# EAGLE schematic TalkieMo_1_0 (EAGLE 6.6.0)
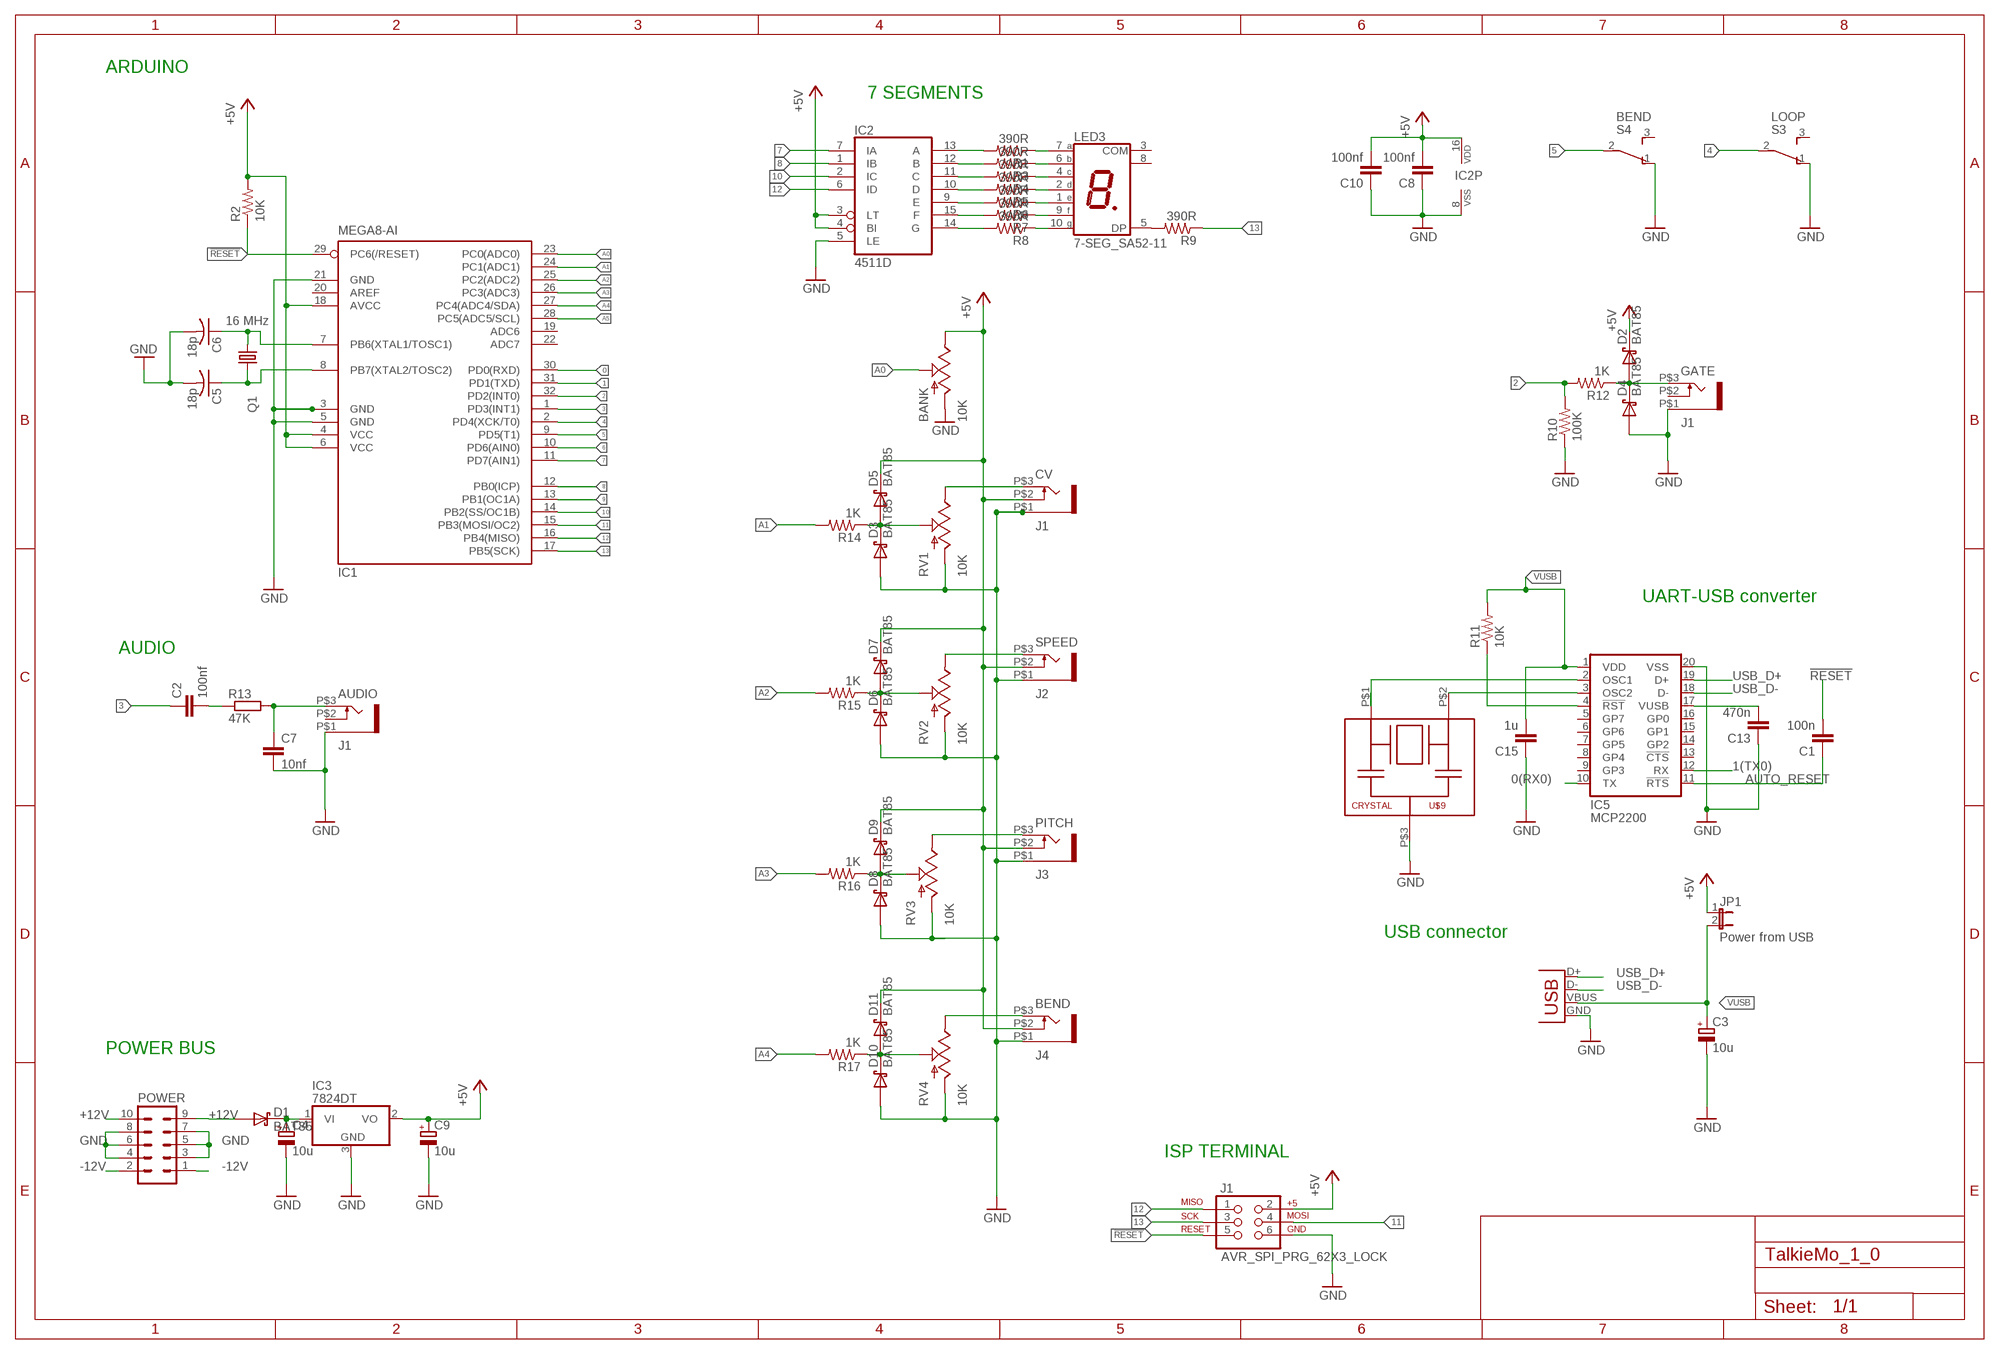
[diagram p0: schematic, sheet 1]

## Parts
AUDIO  J1  THONKICONN  [THONKICONN]
BANK  10K  POT  [ALPS_POT]
BEND  J4  THONKICONN  [THONKICONN]
C1  100n  CAP0805  [0805]
C2  100nf  C-EUC0805  [C0805]
C3  10u  CPOL-EUR/2012-12R  [R/2012-12R]
C4  10u  CPOL-EUR/2012-12R  [R/2012-12R]
C5  18p  C-USC0805K  [C0805K]
C6  18p  C-USC0805K  [C0805K]
C7  10nf  C-EUC0805  [C0805]
C8  100nf  C-EUC0805  [C0805]
C9  10u  CPOL-EUR/2012-12R  [R/2012-12R]
C10  100nf  C-EUC0805  [C0805]
C13  470n  CAP0805  [0805]
C15  1u  CAP0805  [0805]
CV  J1  THONKICONN  [THONKICONN]
D1  BAT85  DIODE-SCHOTTKY_  [SMA-DIODE]
D2  BAT85  DIODE-SCHOTTKY_  [SMA-DIODE]
D3  BAT85  DIODE-SCHOTTKY_  [SMA-DIODE]
D4  BAT85  DIODE-SCHOTTKY_  [SMA-DIODE]
D5  BAT85  DIODE-SCHOTTKY_  [SMA-DIODE]
D6  BAT85  DIODE-SCHOTTKY_  [SMA-DIODE]
D7  BAT85  DIODE-SCHOTTKY_  [SMA-DIODE]
D8  BAT85  DIODE-SCHOTTKY_  [SMA-DIODE]
D9  BAT85  DIODE-SCHOTTKY_  [SMA-DIODE]
D10  BAT85  DIODE-SCHOTTKY_  [SMA-DIODE]
D11  BAT85  DIODE-SCHOTTKY_  [SMA-DIODE]
GATE  J1  THONKICONN  [THONKICONN]
IC1  MEGA8-AI  [TQFP32-08]
IC2  4511D  [SO16]
IC3  7824DT  [TO252]
IC5  MCP2200  [SO20]
J1  AVR_SPI_PRG_62X3_LOCK  [2X3_LOCK]
JP1  Power from USB  JP1E  [JP1]
LED3  7-SEG_SA52-11  [SA52-11]
PITCH  J3  THONKICONN  [THONKICONN]
POWER  10_PIN_HEADER  [MA05-2]
Q1  16 MHz  CRYSTALCTS406  [CTS406]
R1  390R  R-US_M0805  [M0805]
R2  10K  R-US_M0805  [M0805]
R3  390R  R-US_M0805  [M0805]
R4  390R  R-US_M0805  [M0805]
R5  390R  R-US_M0805  [M0805]
R6  390R  R-US_M0805  [M0805]
R7  390R  R-US_M0805  [M0805]
R8  390R  R-US_M0805  [M0805]
R9  390R  R-US_M0805  [M0805]
R10  100K  R-US_M0805  [M0805]
R11  10K  R-US_M0805  [M0805]
R12  1K  R-US_M0805  [M0805]
R13  47K  R-EU_M0805  [M0805]
R14  1K  R-US_M0805  [M0805]
R15  1K  R-US_M0805  [M0805]
R16  1K  R-US_M0805  [M0805]
R17  1K  R-US_M0805  [M0805]
RV1  10K  POT  [ALPS_POT]
RV2  10K  POT  [ALPS_POT]
RV3  10K  POT  [ALPS_POT]
RV4  10K  POT  [ALPS_POT]
S3  LOOP  TL36PO  [TL3XPO]
S4  BEND  TL36PO  [TL3XPO]
SPEED  J2  THONKICONN  [THONKICONN]
U$9  CRYSTAL  [CRYSTAL]
X3  USB  USBPTH-VERTICAL  [USB-B-PTH-VERTICAL]

## Nets
0: IC1.30(PD0(RXD))
0(RX0): IC5.10(TX)
1: IC1.31(PD1(TXD))
1(TX0): IC5.12(RX)
2: IC1.32(PD2(INT0)) R10.2 R12.2
3: C2.1 IC1.1(PD3(INT1))
4: IC1.2(PD4(XCK/T0)) S3.2(P)
5: IC1.9(PD5(T1)) S4.2(P)
6: IC1.10(PD6(AIN0))
7: IC1.11(PD7(AIN1)) IC2.7(IA)
8: IC1.12(PB0(ICP)) IC2.1(IB)
9: IC1.13(PB1(OC1A))
10: IC1.14(PB2(SS/OC1B)) IC2.2(IC)
11: IC1.15(PB3(MOSI/OC2)) J1.4
12: IC1.16(PB4(MISO)) IC2.6(ID) J1.1
13: IC1.17(PB5(SCK)) J1.3 R9.1
!RESET: C1.2 IC1.29(PC6(/RESET)) J1.5 R2.1
+5V [power]: BANK.P$1(E) BEND.P$2 C8.2 C9.+ C10.2 CV.P$2 D2.C D5.C D7.C D9.C D11.C IC1.4(VCC) IC1.6(VCC) IC1.18(AVCC) IC2.3(LT) IC2.4(BI) IC2.16(VDD) IC3.2(VO) J1.2 JP1.1 PITCH.P$2 R2.2 SPEED.P$2
+12V [power]: D1.A POWER.9 POWER.10
-12V [power]: POWER.1 POWER.2
A0: BANK.P$2(S) IC1.23(PC0(ADC0))
A1: IC1.24(PC1(ADC1)) R14.2
A2: IC1.25(PC2(ADC2)) R15.2
A3: IC1.26(PC3(ADC3)) R16.2
A4: IC1.27(PC4(ADC4/SDA)) R17.2
A5: IC1.28(PC5(ADC5/SCL))
AUTO_RESET: C1.1 IC5.11(!RTS)
GND: AUDIO.P$1 BANK.P$3(A) BEND.P$1 C4.- C5.2 C6.2 C7.2 C8.1 C9.- C10.1 C13.1 C15.1 CV.P$1 D3.A D4.A D6.A D8.A D10.A GATE.P$1 IC1.3(GND) IC1.5(GND) IC1.21(GND) IC2.5(LE) IC2.8(VSS) IC3.3(GND) IC5.20(VSS) J1.6 PITCH.P$1 POWER.3 POWER.4 POWER.5 POWER.6 POWER.7 POWER.8 R10.1 RV1.P$3(A) RV2.P$3(A) RV3.P$3(A) RV4.P$3(A) S3.1(O) S4.1(O) SPEED.P$1 U$9.P$3 X3.GND
N$1: C3.- ; supply symbol labelled GND
N$2: CV.P$3 RV1.P$1(E)
N$3: C5.1 IC1.8(PB7(XTAL2/TOSC2)) Q1.1
N$4: LED3.5(DP) R9.2
N$5: RV2.P$1(E) SPEED.P$3
N$6: C4.+ D1.C IC3.1(VI)
N$7: PITCH.P$3 RV3.P$1(E)
N$8: IC2.13(A) R1.2
N$9: D3.C D5.A R14.1 RV1.P$2(S)
N$10: LED3.7(A) R1.1
N$11: IC5.3(OSC2) U$9.P$2
N$12: C6.1 IC1.7(PB6(XTAL1/TOSC1)) Q1.3
N$13: AUDIO.P$3 C7.1 R13.2
N$14: C2.2 R13.1
N$15: IC2.12(B) R3.2
N$16: LED3.6(B) R3.1
N$17: IC2.11(C) R4.2
N$18: LED3.4(C) R4.1
N$19: IC2.10(D) R5.2
N$20: LED3.2(D) R5.1
N$21: IC2.9(E) R6.2
N$22: LED3.1(E) R6.1
N$23: IC2.15(F) R7.2
N$24: LED3.9(F) R7.1
N$25: IC2.14(G) R8.2
N$26: LED3.10(G) R8.1
N$27: IC5.2(OSC1) U$9.P$1
N$28: IC5.4(!RST) R11.1
N$29: C13.2 IC5.17(VUSB)
N$31: D2.A D4.C GATE.P$3 R12.1
N$32: D6.C D7.A R15.1 RV2.P$2(S)
N$35: D8.C D9.A R16.1 RV3.P$2(S)
N$36: BEND.P$3 RV4.P$1(E)
N$38: D10.C D11.A R17.1 RV4.P$2(S)
USB_D+: IC5.19(D+) X3.D+
USB_D-: IC5.18(D-) X3.D-
VUSB [power]: C3.+ C15.2 IC5.1(VDD) JP1.2 R11.2 X3.VBUS
Unconnected: AUDIO.P$2 GATE.P$2 IC1.19(ADC6) IC1.20(AREF) IC1.22(ADC7) IC5.5(GP7) IC5.6(GP6) IC5.7(GP5) IC5.8(GP4) IC5.9(GP3) IC5.13(!CTS) IC5.14(GP2) IC5.15(GP1) IC5.16(GP0) LED3.3(COM) LED3.8(COM) S3.3(S) S4.3(S)

## Notes on the sheet
- ARDUINO
- 7 SEGMENTS
- UART-USB converter
- AUDIO
- USB connector
- POWER BUS
- ISP TERMINAL

## Library data of the parts
AUDIO BEND CV GATE PITCH SPEED = thonkiconn:THONKICONN
BANK RV1-RV4 = SparkFun-Electromechanical:POT; OC_FARNELL: 1769829
C1 = SparkFun:CAP: Capacitor Standard 0603 ceramic capacitor, and 0.1" leaded capacitor.; OC_FARNELL: 1216438
C2 C7 C8 C10 = resistor:C-EU: CAPACITOR, European symbol
C3 C4 C9 = rcl:CPOL-EU: POLARIZED CAPACITOR, European symbol; OC_FARNELL: 1236657
C5 C6 = rcl:C-US: CAPACITOR, American symbol
C13 = SparkFun:CAP: Capacitor Standard 0603 ceramic capacitor, and 0.1" leaded capacitor.; OC_FARNELL: 1457660
C15 = SparkFun:CAP: Capacitor Standard 0603 ceramic capacitor, and 0.1" leaded capacitor.; OC_FARNELL: 2112910
D1-D11 = SteveMarple:DIODE-SCHOTTKY; OC_FARNELL: 1612329
IC1 = atmel:MEGA8: MICROCONTROLLER 8 Kbytes FLASH, 1 kbytes SRAM, 512 bytes EEPROM, USART, 6-channel 10 bit ADC, 2-channel 8 bit ADC Pin compatible with Atmega48, ATMega88, ATMega168 Source: avr.lbr; MPN: ATMEGA8-16AU; OC_FARNELL: 9171371; OC_NEWARK: 73M8863
IC2 = 45xx:4511: BCD to 7-segment LATCH/DECODER/DRIVER
IC3 = linear:78*: Positive VOLTAGE REGULATOR Source: http://cache.national.com/ds/LM/LM78L05.pdf http://www.fairchildsemi.com/ds/LM/LM7805.pdf
IC5 = SteveMarple:MCP2200: MCP2200 Microchip USB-UART interface.; OC_FARNELL: 1781148
J1 = SparkFun-Connectors:AVR_SPI_PRG_6: AVR ISP 6 Pin This is the reduced ISP connector for AVR programming. Common on Arduino. This footprint will take up less PCB space and can be used with a 10-pin to 6-pin adapter such as SKU: BOB-08508
JP1 = jumper:JP1E: JUMPER
LED3 = display-kingbright:7-SEG_: Kingbright 14.2mm (0.56 INCH) SINGLE DIGIT NUMERIC DUISPLAY Source: SA56-11EWA(Ver1189471036.pdf; OC_FARNELL: 1168602; OC_NEWARK: unknown
POWER = TomW:10_PIN_HEADER: PIN HEADER; OC_FARNELL: unknown; OC_NEWARK: unknown
Q1 = crystal:CRYSTAL: CRYSTAL; OC_FARNELL: unknown; OC_MOUSER: ECS-160-18-23A-EN-TR; OC_NEWARK: unknown
R1-R12 R14-R17 = resistor:R-US_: RESISTOR, American symbol
R13 = resistor:R-EU_: RESISTOR, European symbol
S3 S4 = switch:TL36PO: TINY SWITCH ON - ON Source: http://www2.produktinfo.conrad.com/datenblaetter/700000-724999/705152-da-01-de-Subminiaturschalter_TL_36YO.pdf; OC_FARNELL: 9472967
U$9 = 57466:CRYSTAL; OC_FARNELL: 1218535; OC_MOUSER: 581-PBRC12.00HR50X
X3 = SteveMarple:USB: USB Connectors USB-B-PTH is fully proven SKU : PRT-00139 USB-miniB is fully proven SKU : PRT-00587 USB-A-PCB is untested. USB-A-H is throughly reviewed, but untested. Spark Fun Electronics SKU : PRT-00437 USB-B-SMT is throughly reviewed, but untested. Needs silkscreen touching up. USB-A-S has not been used/tested USB-MB-H has not been used/tested; 0C_FARNELL: 1308876

## Net classes
0 default: width 0.254 mm
1 power: width 0.61 mm
2 ground: width 0.61 mm